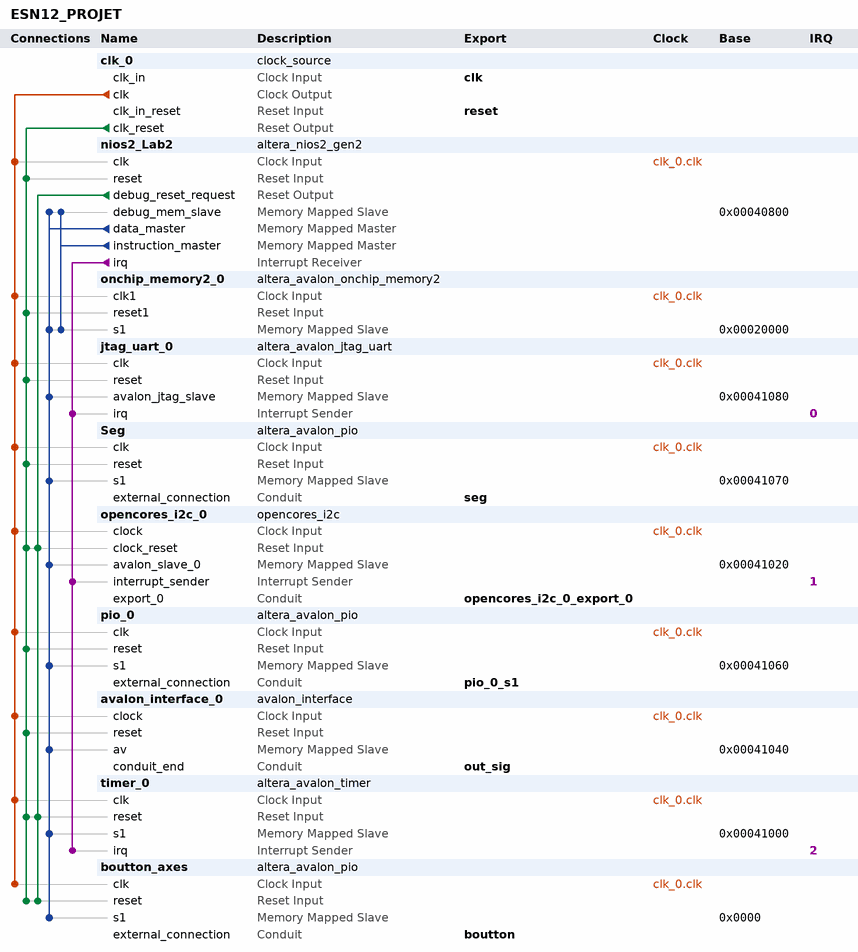
[diagram p0: system contents]
# Platform Designer (Qsys) system ESN12_PROJET, MAX 10 10M50DAF484C7G
# Parameters at their usual value, and those the tool derives, are not listed.
package require -exact qsys 18.1
create_system ESN12_PROJET
set_project_property DEVICE_FAMILY {MAX 10}
set_project_property DEVICE 10M50DAF484C7G

add_instance clk_0 clock_source 18.1
set_instance_parameter_value clk_0 clockFrequency 50000000

add_instance nios2_Lab2 altera_nios2_gen2 18.1
set_instance_parameter_value nios2_Lab2 dcache_size 2048
set_instance_parameter_value nios2_Lab2 exceptionSlave onchip_memory2_0.s1
set_instance_parameter_value nios2_Lab2 icache_size 4096
set_instance_parameter_value nios2_Lab2 impl Tiny
set_instance_parameter_value nios2_Lab2 resetSlave onchip_memory2_0.s1

add_instance onchip_memory2_0 altera_avalon_onchip_memory2 18.1
set_instance_parameter_value onchip_memory2_0 dataWidth 32
set_instance_parameter_value onchip_memory2_0 dualPort false
set_instance_parameter_value onchip_memory2_0 initMemContent true
set_instance_parameter_value onchip_memory2_0 initializationFileName C:/Users/Ahmed/Documents/GitHub/EL-Wasmi_Lab2/software/Lab2/mem_init/Lab2_sys_onchip_memory2_0.hex
set_instance_parameter_value onchip_memory2_0 memorySize 131072
set_instance_parameter_value onchip_memory2_0 useNonDefaultInitFile true

add_instance jtag_uart_0 altera_avalon_jtag_uart 18.1
set_instance_parameter_value jtag_uart_0 simInteractiveOptions NO_INTERACTIVE_WINDOWS

add_instance Seg altera_avalon_pio 18.1
set_instance_parameter_value Seg direction Output
set_instance_parameter_value Seg width 8

add_instance opencores_i2c_0 opencores_i2c 9.1

add_instance pio_0 altera_avalon_pio 18.1
set_instance_parameter_value pio_0 direction Output
set_instance_parameter_value pio_0 width 1

add_instance avalon_interface_0 avalon_interface 1.0

add_instance timer_0 altera_avalon_timer 18.1
set_instance_parameter_value timer_0 period 1
set_instance_parameter_value timer_0 periodUnits SEC

add_instance boutton_axes altera_avalon_pio 18.1
set_instance_parameter_value boutton_axes direction Input
set_instance_parameter_value boutton_axes width 1

# connections
add_connection clk_0.clk avalon_interface_0.clock clock
add_connection clk_0.clk boutton_axes.clk clock
add_connection clk_0.clk jtag_uart_0.clk clock
add_connection clk_0.clk nios2_Lab2.clk clock
add_connection clk_0.clk onchip_memory2_0.clk1 clock
add_connection clk_0.clk opencores_i2c_0.clock clock
add_connection clk_0.clk pio_0.clk clock
add_connection clk_0.clk Seg.clk clock
add_connection clk_0.clk timer_0.clk clock
add_connection clk_0.clk_reset avalon_interface_0.reset reset
add_connection clk_0.clk_reset boutton_axes.reset reset
add_connection clk_0.clk_reset jtag_uart_0.reset reset
add_connection clk_0.clk_reset nios2_Lab2.reset reset
add_connection clk_0.clk_reset onchip_memory2_0.reset1 reset
add_connection clk_0.clk_reset opencores_i2c_0.clock_reset reset
add_connection clk_0.clk_reset pio_0.reset reset
add_connection clk_0.clk_reset Seg.reset reset
add_connection clk_0.clk_reset timer_0.reset reset
add_connection nios2_Lab2.debug_reset_request boutton_axes.reset reset
add_connection nios2_Lab2.debug_reset_request opencores_i2c_0.clock_reset reset
add_connection nios2_Lab2.debug_reset_request timer_0.reset reset
add_connection nios2_Lab2.data_master avalon_interface_0.av avalon
set_connection_parameter_value nios2_Lab2.data_master/avalon_interface_0.av baseAddress 0x00041040
add_connection nios2_Lab2.data_master boutton_axes.s1 avalon
set_connection_parameter_value nios2_Lab2.data_master/boutton_axes.s1 baseAddress 0x0000
add_connection nios2_Lab2.data_master jtag_uart_0.avalon_jtag_slave avalon
set_connection_parameter_value nios2_Lab2.data_master/jtag_uart_0.avalon_jtag_slave baseAddress 0x00041080
add_connection nios2_Lab2.data_master nios2_Lab2.debug_mem_slave avalon
set_connection_parameter_value nios2_Lab2.data_master/nios2_Lab2.debug_mem_slave baseAddress 0x00040800
add_connection nios2_Lab2.data_master onchip_memory2_0.s1 avalon
set_connection_parameter_value nios2_Lab2.data_master/onchip_memory2_0.s1 baseAddress 0x00020000
add_connection nios2_Lab2.data_master opencores_i2c_0.avalon_slave_0 avalon
set_connection_parameter_value nios2_Lab2.data_master/opencores_i2c_0.avalon_slave_0 baseAddress 0x00041020
add_connection nios2_Lab2.data_master pio_0.s1 avalon
set_connection_parameter_value nios2_Lab2.data_master/pio_0.s1 baseAddress 0x00041060
add_connection nios2_Lab2.data_master Seg.s1 avalon
set_connection_parameter_value nios2_Lab2.data_master/Seg.s1 baseAddress 0x00041070
add_connection nios2_Lab2.data_master timer_0.s1 avalon
set_connection_parameter_value nios2_Lab2.data_master/timer_0.s1 baseAddress 0x00041000
add_connection nios2_Lab2.instruction_master nios2_Lab2.debug_mem_slave avalon
set_connection_parameter_value nios2_Lab2.instruction_master/nios2_Lab2.debug_mem_slave baseAddress 0x00040800
add_connection nios2_Lab2.instruction_master onchip_memory2_0.s1 avalon
set_connection_parameter_value nios2_Lab2.instruction_master/onchip_memory2_0.s1 baseAddress 0x00020000
add_connection nios2_Lab2.irq jtag_uart_0.irq interrupt
set_connection_parameter_value nios2_Lab2.irq/jtag_uart_0.irq irqNumber 0
add_connection nios2_Lab2.irq opencores_i2c_0.interrupt_sender interrupt
set_connection_parameter_value nios2_Lab2.irq/opencores_i2c_0.interrupt_sender irqNumber 1
add_connection nios2_Lab2.irq timer_0.irq interrupt
set_connection_parameter_value nios2_Lab2.irq/timer_0.irq irqNumber 2

# exported interfaces
add_interface boutton conduit end
set_interface_property boutton EXPORT_OF boutton_axes.external_connection
add_interface clk clock sink
set_interface_property clk EXPORT_OF clk_0.clk_in
add_interface opencores_i2c_0_export_0 conduit end
set_interface_property opencores_i2c_0_export_0 EXPORT_OF opencores_i2c_0.export_0
add_interface out_sig conduit end
set_interface_property out_sig EXPORT_OF avalon_interface_0.conduit_end
add_interface pio_0_s1 conduit end
set_interface_property pio_0_s1 EXPORT_OF pio_0.external_connection
add_interface reset reset sink
set_interface_property reset EXPORT_OF clk_0.clk_in_reset
add_interface seg conduit end
set_interface_property seg EXPORT_OF Seg.external_connection

set_interconnect_requirement {$system} qsys_mm.clockCrossingAdapter HANDSHAKE
set_interconnect_requirement {$system} qsys_mm.enableEccProtection FALSE
set_interconnect_requirement {$system} qsys_mm.insertDefaultSlave FALSE
set_interconnect_requirement {$system} qsys_mm.maxAdditionalLatency 1

save_system ESN12_PROJET.qsys
